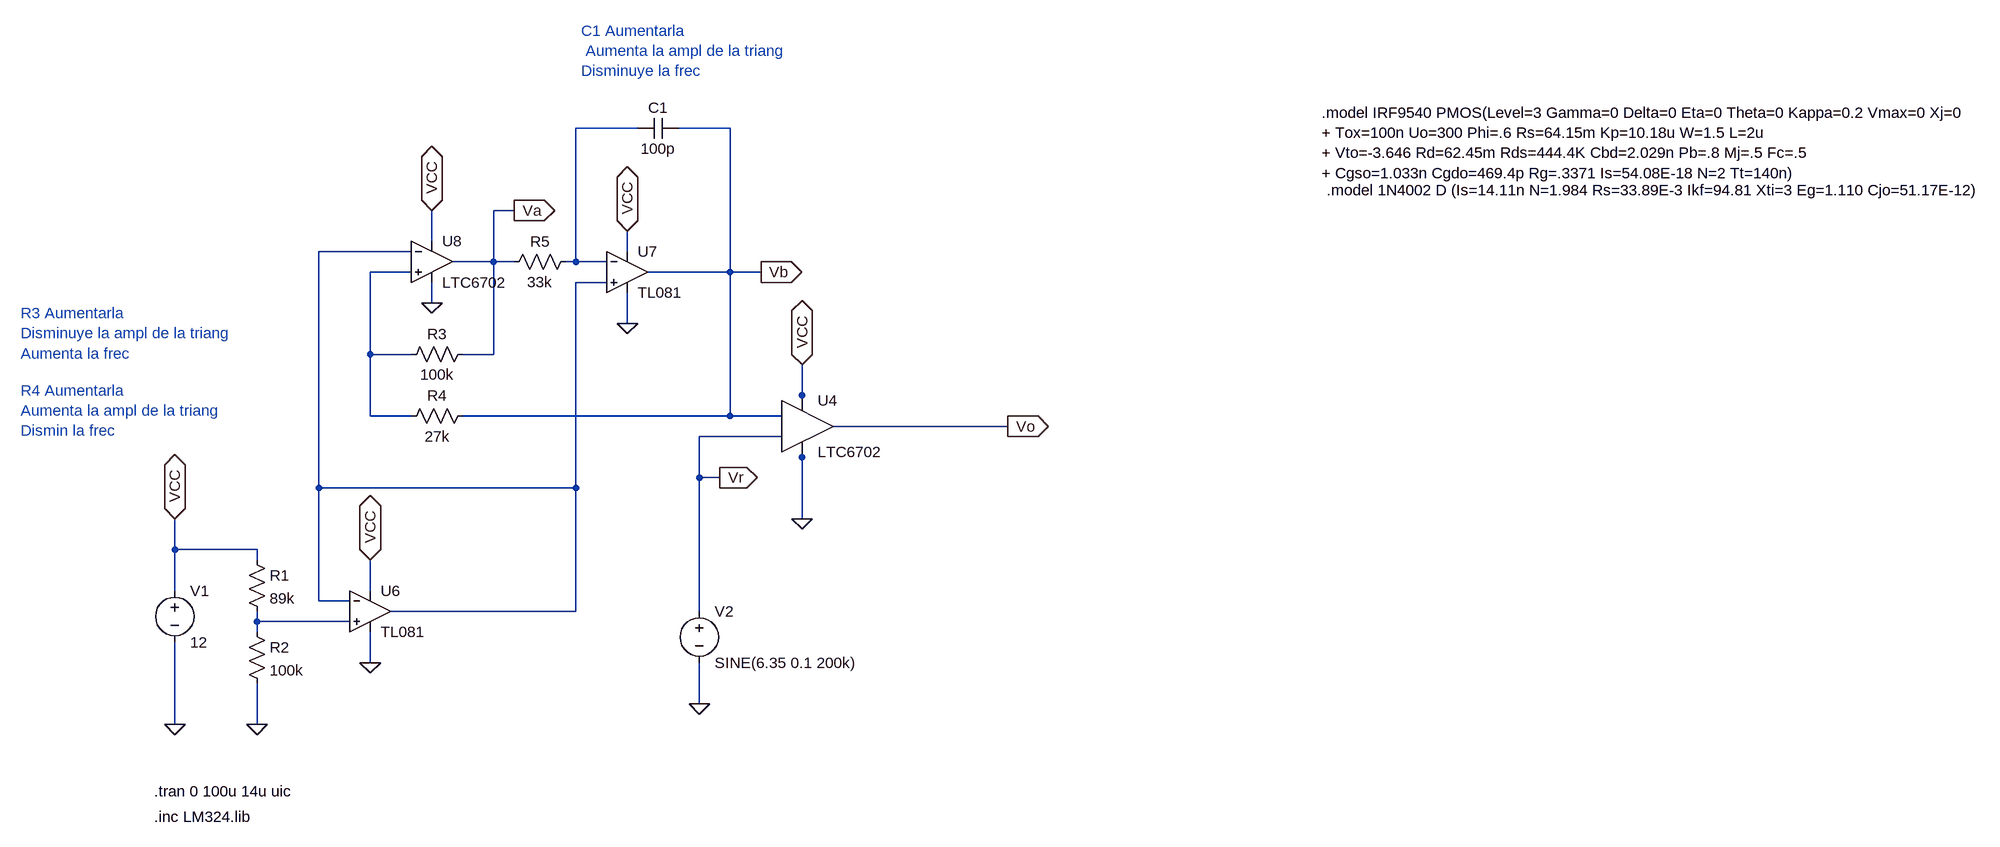
[diagram p0: schematic Ejemplo de modulador triangular en LTSPICE.asc]
* Ejemplo de modulador triangular en LTSPICE.asc
R5 N001 Va 33k
R1 VCC N004 89k
R2 N004 0 100k
V1 VCC 0 12
R3 Va N003 100k
R4 Vb N003 27k
V2 Vr 0 SINE(6.35 0.1 200k)
C1 Vb N001 100p
XU4 Vr Vb VCC 0 Vo LTC6702
XU8 N003 N002 VCC 0 Va LTC6702  ; pins In+ In- V+ V- OUT
* U7: TL081 (symbol TL081 not available, pins judged from their places): In+=N002 In-=N001 V+=VCC V-=0 OUT=Vb
* U6: TL081 (symbol TL081 not available, pins judged from their places): In+=N004 In-=N002 V+=VCC V-=0 OUT=N002
.tran 0 100u 14u uic
.model IRF9540 PMOS(Level=3 Gamma=0 Delta=0 Eta=0 Theta=0 Kappa=0.2 Vmax=0 Xj=0
+ Tox=100n Uo=300 Phi=.6 Rs=64.15m Kp=10.18u W=1.5 L=2u
+ Vto=-3.646 Rd=62.45m Rds=444.4K Cbd=2.029n Pb=.8 Mj=.5 Fc=.5
+ Cgso=1.033n Cgdo=469.4p Rg=.3371 Is=54.08E-18 N=2 Tt=140n)
.model 1N4002 D (Is=14.11n N=1.984 Rs=33.89E-3 Ikf=94.81 Xti=3 Eg=1.110 Cjo=51.17E-12)
.inc LM324.lib
* R4 Aumentarla
* Aumenta la ampl de la triang
* Dismin la frec
* R3 Aumentarla
* Disminuye la ampl de la triang
* Aumenta la frec
* C1 Aumentarla
*  Aumenta la ampl de la triang
* Disminuye la frec
.lib LTC3.lib
.backanno
.end

* Results of the author's LTspice run, read from the files saved beside the schematic
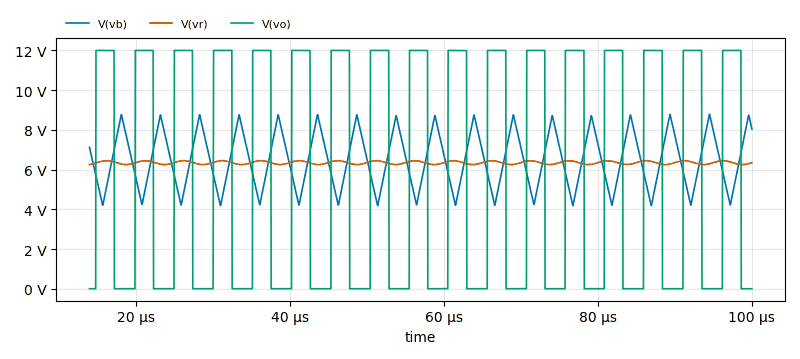
[diagram p1: Transient Analysis of Ejemplo de modulador triangular en LTSPICE.asc, plotted from the saved traces]
* Transient Analysis, 1 run:
*   V(vb): min 4.184 V, max 8.783 V, average 6.475 V, rms 6.615 V, last 8.049 V
*   V(vr): min 6.25 V, max 6.45 V, average 6.349 V, rms 6.35 V, last 6.35 V
*   V(vo): min -2.617 mV, max 12 V, average 5.706 V, rms 8.256 V, last 0 V